# EAGLE design Carte_power (EAGLE 6.6.0)
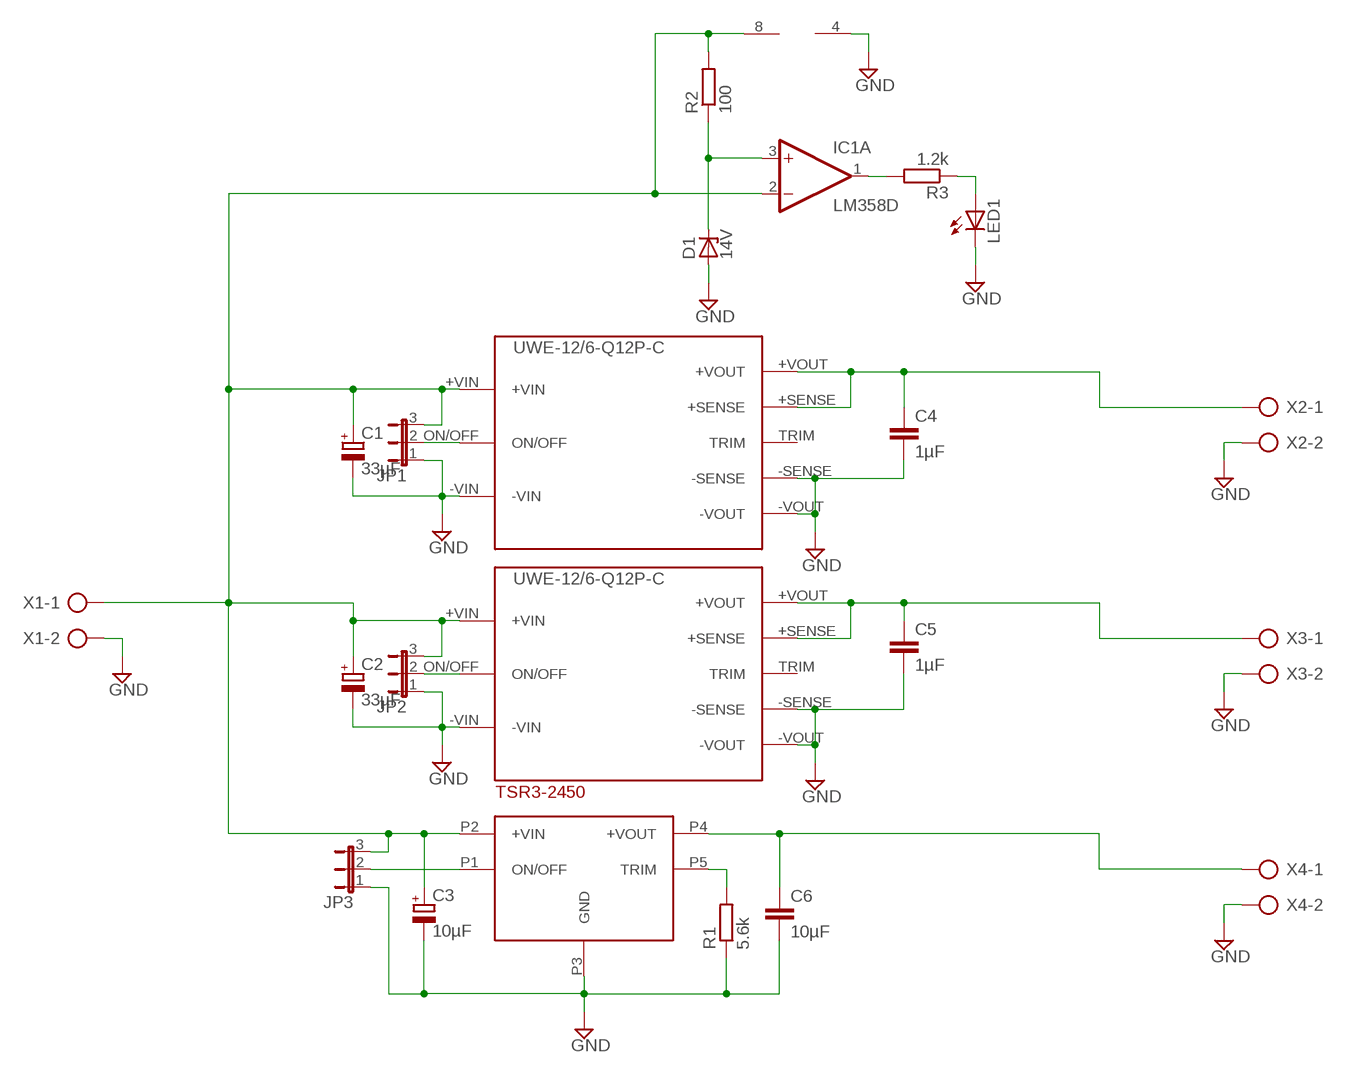
[diagram p0: schematic, sheet 1]

## Parts
C1  33µF  CPOL-EU153CLV-1010  [153CLV-1010]
C2  33µF  CPOL-EU153CLV-1010  [153CLV-1010]
C3  10µF  CPOL-EU153CLV-1010  [153CLV-1010]
C4  1µF  C-EUC2012  [C2012]
C5  1µF  C-EUC2012  [C2012]
C6  10µF  C-EUC2012  [C2012]
D1  14V  1N5333  [C1702-15]
IC1  LM358D  [SO08]
JP1  JP2E  [JP2]
JP2  JP2E  [JP2]
JP3  JP2E  [JP2]
LED1  LED5MM  [LED5MM]
R1  5.6k  R-EU_R2012  [R2012]
R2  100  R-EU_R2012  [R2012]
R3  1.2k  R-EU_R2012  [R2012]
U$1  UWE-12/6-Q12P-C  [UWE-12/6-Q12P-C]
U$2  TSR3-2450  [TSR3-2450]
U$4  UWE-12/6-Q12P-C  [UWE-12/6-Q12P-C]
X1  AK300/2  [AK300/2]
X2  AK300/2  [AK300/2]
X3  AK300/2  [AK300/2]
X4  AK300/2  [AK300/2]

## Nets
+VIN: C1.+ C2.+ C3.+ IC1.2(A:-IN) IC1.8(P:V+) JP1.3 JP2.3 JP3.3 R2.2 U$1.+VIN U$2.P2(+VIN) U$4.+VIN X1.1
GND: C1.- C2.- C3.- C4.2 C5.2 C6.2 D1.A IC1.4(P:V-) JP1.1 JP2.1 JP3.1 LED1.K(C) R1.1 U$1.-SENSE U$1.-VIN U$1.-VOUT U$2.P3(GND) U$4.-SENSE U$4.-VIN U$4.-VOUT X1.2 X2.2 X3.2 X4.2
N$1: D1.C IC1.3(A:+IN) R2.1
N$2: JP1.2 U$4.ON/OFF
N$3: JP2.2 U$1.ON/OFF
N$4: R1.2 U$2.P5(TRIM)
N$5: C6.1 U$2.P4(+VOUT) X4.1
N$6: C5.1 U$1.+SENSE U$1.+VOUT X3.1
N$7: C4.1 U$4.+SENSE U$4.+VOUT X2.1
N$8: JP3.2 U$2.P1(ON/OFF)
N$10: IC1.1(A:OUT) R3.2
N$11: LED1.A R3.1
Unconnected: IC1.5(B:+IN) IC1.6(B:-IN) IC1.7(B:OUT) U$1.TRIM U$4.TRIM

## Library data of the parts
C1-C3 = resistor:CPOL-EU: POLARIZED CAPACITOR, European symbol
C4-C6 = resistor:C-EU: CAPACITOR, European symbol
D1 = diode:1N5333: Z DIODE 3.3 V, 5W, 5 percent (Motorola)
IC1 = linear:LM358: OP AMP also LM158; LM258; LM2904 Source: http://cache.national.com/ds/LM/LM158.pdf
JP1-JP3 = jumper:JP2E: JUMPER
LED1 = adafruit:LED: LED OSRAM: - CHIPLED LG R971, LG N971, LY N971, LG Q971, LY Q971, LO R971, LY R971 LH N974, LH R974 LS Q976, LO Q976, LY Q976 LO Q996 - Hyper CHIPLED LW Q18S LB Q993, LB Q99A, LB R99A - SideLED LS A670, LO A670, LY A670, LG A670, LP A670 LB A673, LV A673, LT A673, LW A673 LH A674 LY A675 LS A676, LA A676, LO A676, LY A676, LW A676 LS A679, LY A679, LG A679 - Hyper Micro SIDELED® LS Y876, LA Y876, LO Y876, LY Y876 LT Y87S - SmartLED LW L88C, LW L88S LB L89C, LB L89S, LG L890 LS L89K, LO L89K, LY L89K LS L896, LA L896, LO L896, LY L896 - TOPLED LS T670, LO T670, LY T670, LG T670, LP T670 LSG T670, LSP T670, LSY T670, LOP T670, LYG T670 LG T671, LOG T671, LSG T671 LB T673, LV T673, LT T673, LW T673 LH T674 LS T676, LA T676, LO T676, LY T676, LB T676, LH T676, LSB T676, LW T676 LB T67C, LV T67C, LT T67C, LS T67K, LO T67K, LY T67K, LW E67C LS E67B, LA E67B, LO E67B, LY E67B, LB E67C, LV E67C, LT E67C LW T67C LS T679, LY T679, LG T679 LS T770, LO T770, LY T770, LG T770, LP T770 LB T773, LV T773, LT T773, LW T773 LH T774 LS E675, LA E675, LY E675, LS T675 LS T776, LA T776, LO T776, LY T776, LB T776 LHGB T686 LT T68C, LB T68C - Hyper Mini TOPLED® LB M676 - Mini TOPLED Santana® LG M470 LS M47K, LO M47K, LY M47K Source: http://www.osram.convergy.de/
R1-R3 = resistor:R-EU_: RESISTOR, European symbol
U$1 U$4 = Mercier:UWE-12/6-Q12P-C: DC/DC converter - 12V6A - Farnell 1652245
U$2 = Mercier:TSR3-2450: DC/DC converter - 5V 3A - Farnell 2080626
X1-X4 = con-ptr500:AK300/2: CONNECTOR; OC_FARNELL: unknown; OC_NEWARK: unknown

## Board
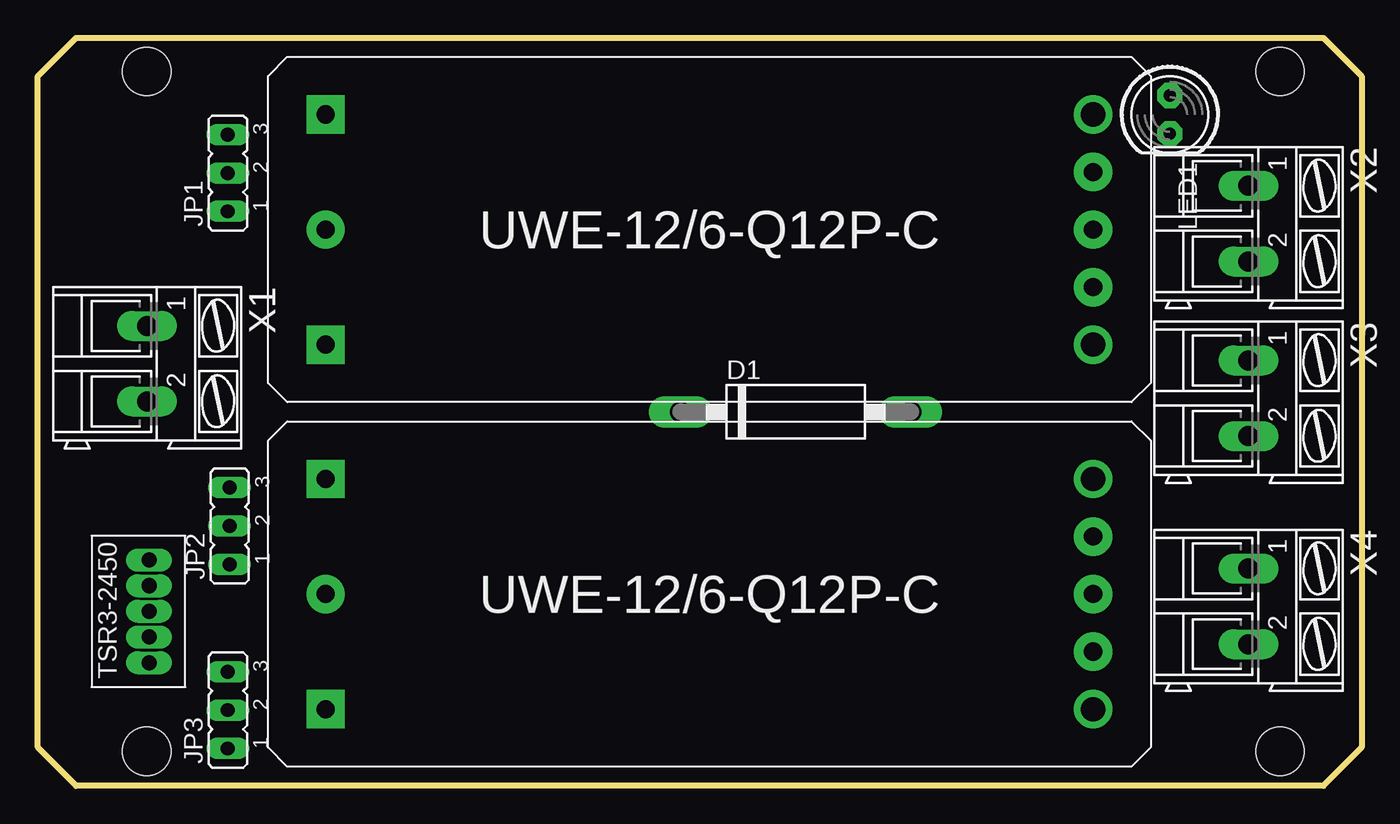
[diagram p1: board, top side]
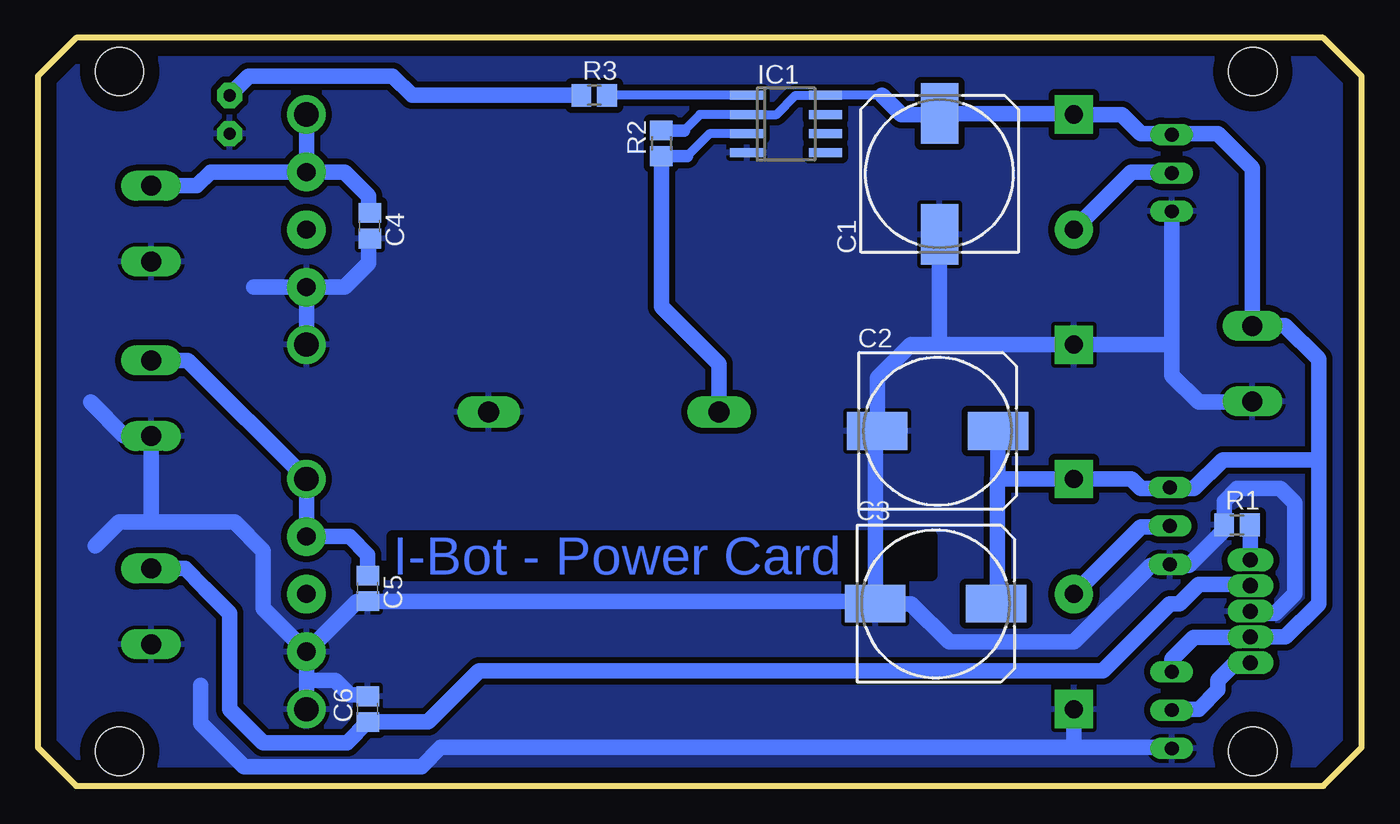
[diagram p2: board, bottom side, seen from below]

Size 87.63 x 49.53 mm. Coordinates in mm from the lower left corner, seen from the top.
Outline: 0,46.99 2.54,49.53 85.09,49.53 87.63,46.99 87.63,2.54 85.09,0 2.54,0 0,2.54 0,46.99
Copper layers (1*16): Top 0.035mm / dielectric 1.5mm / Bottom 0.035mm
Design rules "default": minimum track width 10mil, minimum drill 24mil, track to track 8mil, track to pad 8mil, pad to pad 8mil, via to via 8mil, smd to smd 8mil, copper to edge 40mil, drill to drill 8mil, minimum pad ring 10mil, minimum via ring 8mil, stop-mask expansion 4mil, vias tented up to drill 0mil, thermal gap 10mil
Holes 3.2 mm at 7.22,47.3 7.22,2.3 82.22,2.3 82.22,47.3

### Footprints (pad centres in the part's own frame; a part is rotated, then mirrored left to right if it is on the bottom)
153CLV-1010 = smd 4 x 2.5: + 4,0; - -4,0
C2012 = smd 1.3 x 1.5: 1 -0.85,0; 2 0.85,0
C1702-15 = drill 1.397 long: A 7.62,0; C -7.62,0
SO08 = smd 0.6 x 2.2: 1 -1.905,-2.6; 2 -0.635,-2.6; 3 0.635,-2.6; 4 1.905,-2.6; 5 1.905,2.6; 6 0.635,2.6; 7 -0.635,2.6; 8 -1.905,2.6
JP2 = drill 0.914 long: 1 -2.54,0; 2 0,0; 3 2.54,0
LED5MM = drill 0.813 pad 1.676 octagon: A -1.27,0; K 1.27,0
R2012 = smd 1.3 x 1.5: 1 -0.85,0; 2 0.85,0
UWE-12/6-Q12P-C = drill 1.2 pad 2.54: +SENSE 50.8,-3.81; -SENSE 50.8,-11.43; ON/OFF 0,-7.62; TRIM 50.8,-7.62 | drill 1.2 pad 2.54 square: +VIN 0,0; -VIN 0,-15.24 | drill 1.6 pad 2.54: +VOUT 50.8,0; -VOUT 50.8,-15.24
TSR3-2450 = drill 1 pad 1.27 long: P1 3.4,0; P2 1.7,0; P3 0,0; P4 -1.7,0; P5 -3.4,0
AK300/2 = drill 1.321 long: 1 -2.515,0; 2 2.489,0

### Placement (x,y rotation side)
C1  27.94,40.51 90 bottom
C2  28.07,23.5 0 bottom
C3  28.19,12.07 0 bottom
C4  65.66,37.08 270 bottom
C5  65.79,13.08 270 bottom
C6  65.79,5.08 90 bottom
D1  50.16,24.77 0 top
IC1  38.1,43.81 270 bottom
JP1  12.57,40.58 90 top
JP2  12.7,17.21 90 top
JP3  12.57,5.02 90 top
LED1  74.93,44.45 270 top
R1  8.25,17.27 0 bottom
R2  46.36,42.55 90 bottom
R3  50.8,45.72 0 bottom
U$1  19.05,20.32 0 top
U$2  7.37,11.56 270 top
U$4  19.05,44.45 0 top
X1  7.24,27.94 270 top
X2  80.14,37.21 270 top
X3  80.14,25.65 270 top
X4  80.14,11.87 270 top

### Tracks (layer width: path | path; a pad name or v marks a point on that pad's centre or on a via)
+VIN
  Bottom 0.406: C1.+ 28,44.45
  Bottom 0.61: 44.87,43.39 43.81,44.45 IC1.2 38.73,44.45 37.46,45.72 IC1.8 31.75,45.72
  Bottom 0.813: 44.87,43.39 R2.2
  Bottom 1.016: C1.+ 19.11,44.51 U$4.+VIN 15.88,44.45 14.6,43.18 12.64,43.18 JP1.3 12.51,43.18 9.52,43.18 7.24,40.89 X1.1 7.21,30.48 5.08,30.48 2.86,28.26 2.86,21.59 | JP2.3 12.76,19.68 | 12.76,19.68 14.6,19.68 15.24,20.32 U$1.+VIN 24.13,20.32 | 24.13,20.32 24.07,20.38 C2.+ | C3.+ 24.13,12.13 24.13,20.32 | JP3.3 12.57,8.38 11.11,9.84 7.38,9.84 U$2.P2 5.07,9.86 2.86,12.07 2.86,21.59 | 12.76,19.68 11.11,19.68 9.21,21.59 2.86,21.59 | 28,44.45 30.48,44.45 31.75,45.72
GND
  Bottom 1.016: X1.2 7.29,25.4 10.79,25.4 12.57,27.18 12.57,29.21 | 12.57,29.21 JP1.1 | 12.57,29.21 U$4.-VIN 27.94,29.21 | 27.94,29.21 29.84,29.21 32.07,26.99 C2.- 32.19,23.37 C3.- | C1.- 27.94,29.21 | C3.- 29.84,12.07 27.3,9.53 19.05,9.53 13.97,14.61 12.76,14.61 JP2.1 12.64,14.61 11.43,14.61 9.11,16.93 R1.1 9.11,18.84 8.25,19.68 5.4,19.68 4.45,18.73 4.45,12.7 5.71,11.43 7.24,11.43 U$2.P3 | C3.- 32.36,12.23 C5.2 66.51,12.23 U$1.-SENSE | U$1.-SENSE 69.85,6.98 | 69.85,6.98 U$1.-VOUT | C6.2 65.89,6.03 66.99,6.03 67.94,6.98 69.85,6.98 | U$1.-SENSE 72.71,11.75 72.71,15.56 74.61,17.46 80.01,17.46 | 80.01,17.46 80.14,17.59 X3.2 81.9,23.17 84.14,25.4 | 83.82,15.88 82.23,17.46 80.01,17.46 | U$4.-VOUT U$4.-SENSE | C4.2 65.72,36.17 65.72,34.61 67.31,33.02 U$4.-SENSE | U$4.-SENSE 73.34,33.02 | JP3.1 12.64,2.54 19.05,2.54 | U$1.-VIN 19.05,2.54 | 19.05,2.54 60.96,2.54 62.23,1.27 73.98,1.27 76.83,4.13 76.83,6.67
  pour Bottom (isolate 0.406): 0,46.99 2.54,49.53 85.09,49.53 87.63,46.99 87.63,2.54 85.09,0 2.54,0 0,2.54
N$1
  Bottom 0.61: IC1.3 43.18,43.18 44.66,41.7
  Bottom 0.813: 44.66,41.7 R2.1
  Bottom 1.016: R2.1 46.36,31.75 42.55,27.94 D1.C
N$2
  Bottom 1.016: JP1.2 12.64,40.64 15.24,40.64 U$4.ON/OFF
N$3
  Bottom 1.016: JP2.2 12.76,17.14 14.6,17.14 U$1.ON/OFF
N$4
  Bottom 1.016: R1.2 7.37,17.23 U$2.P5
N$5
  Bottom 1.016: U$2.P4 7.44,13.34 10.79,13.34 12.06,12.07 12.7,12.07 17.14,7.62 58.42,7.62 61.81,4.23 C6.1 67.16,2.86 72.71,2.86 74.93,5.08 74.93,11.43 76.62,13.12 77.89,14.39 X4.1
N$6
  Bottom 1.016: C5.1 65.79,15.3 66.99,16.51 U$1.+SENSE U$1.+VOUT 77.7,28.17 X3.1
N$7
  Bottom 1.016: U$4.+VOUT U$4.+SENSE | C4.1 65.72,38 65.72,39.05 67.31,40.64 U$4.+SENSE | U$4.+SENSE 74.3,40.64 76.2,40.64 77.11,39.73 X2.1
N$8
  Bottom 1.016: JP3.2 12.51,5.08 10.79,5.08 9.52,6.35 9.52,6.98 8.35,8.16 U$2.P1
N$10
  Bottom 0.61: IC1.1 R3.2
N$11
  Bottom 1.016: R3.1 62.86,45.72 64.14,46.99 73.66,46.99 LED1.A

### Text on the board
Bottom: I-Bot - Power Card